# EAGLE schematic lt3652_charger (EAGLE 8.6.3)
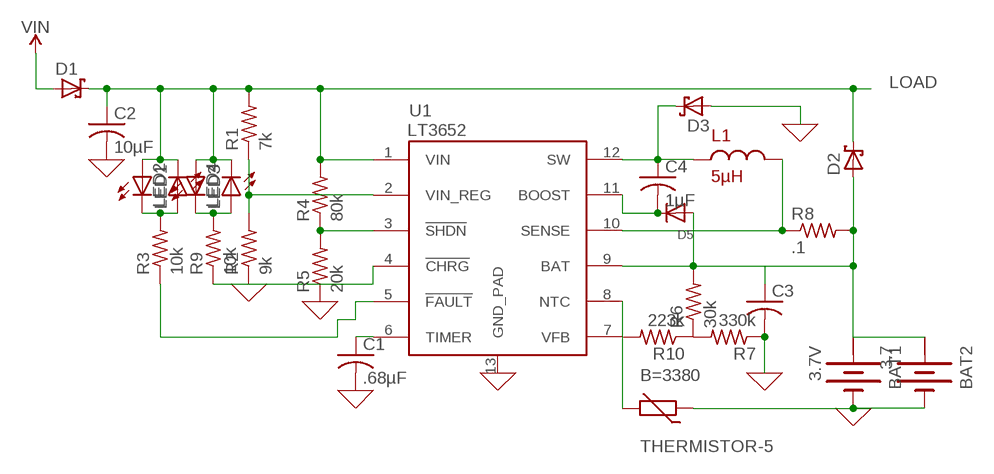
[diagram p0: schematic, sheet 1]

## Parts
B=3380  THERMISTOR-5  [R-5]
BAT1  3.7V  BATTERY  [BATTERY]
BAT2  3.7  BATTERY  [BATTERY]
C1  .68µF  C-US025-024X044  [C025-024X044]
C2  10µF  C-US025-024X044  [C025-024X044]
C3  C-US025-024X044  [C025-024X044]
C4  1µF  C-US025-024X044  [C025-024X044]
D1  SCHOTTKY-DIODEAG  [AG]
D2  SCHOTTKY-DIODEAG  [AG]
D3  SCHOTTKY-DIODEAG  [AG]
D5  DIODEDO-1N4148  [DO-1N4148]
L1  5µH  L  (no package)
LED1  LED5MM  [LED5MM]
LED2  LED5MM  [LED5MM]
LED3  LED5MM  [LED5MM]
LED4  LED5MM  [LED5MM]
R1  7k  R-US_0204/2V  [0204V]
R2  9k  R-US_0204/2V  [0204V]
R3  10k  R-US_0204/2V  [0204V]
R4  80k  R-US_0204/2V  [0204V]
R5  20k  R-US_0204/2V  [0204V]
R6  30k  R-US_0204/2V  [0204V]
R7  330k  R-US_0204/2V  [0204V]
R8  .1  R-US_0204/2V  [0204V]
R9  10k  R-US_0204/2V  [0204V]
R10  223k  R-US_0204/2V  [0204V]
U1  LT3652  [MSOP-12_GND]

## Nets
0: B=3380.1 BAT1.- BAT2.- C1.2 C2.2 C3.2 D3.A R2.1 R5.1 R7.1 U1.13(GND_PAD) ; supply symbol labelled GND
LOAD: C2.1 D1.C D2.C LED1.A LED2.K(C) LED3.A LED4.K(C) R1.2 R4.2 U1.1(VIN)
N$1: C1.1 U1.6(TIMER)
N$2: R1.1 R2.2 U1.2(VIN_REG)
N$3: R4.1 R5.2 U1.3(!SHDN)
N$4: LED1.K(C) LED2.A R3.2
N$5: LED3.K(C) LED4.A
N$6: R3.1 U1.5(!FAULT)
N$7: L1.2 R8.1 U1.10(SENSE)
N$8: BAT1.+ BAT2.+ C3.1 D2.A D5.A R6.2 R8.2 U1.9(BAT)
N$9: R6.1 R7.2
N$10: C4.1 D3.C L1.1 U1.12(SW)
N$11: C4.2 D5.C U1.11(BOOST)
N$12: R9.1 U1.4(!CHRG)
N$13: B=3380.2 U1.8(NTC)
VIN: D1.A
Unconnected: R9.2 R10.1 R10.2 U1.7(VFB)

## Power pins joined to a net without a drawn wire
+: BAT1.+@1(+) BAT2.+@1(+)

## Library data of the parts
B=3380 = varistor:THERMISTOR: THERMISTOR
BAT1 BAT2 = special:BATTERY: BATTERY
C1-C4 = adafruit:C-US: CAPACITOR, American symbol
D1-D3 = adafruit:SCHOTTKY-DIODE: Schottky Diode
D5 = adafruit:DIODE: Diode SMADIODE - SMA Surface Mount Package 20V 1A Schottky Diode Digikey: 641-1014-6-ND DO-1N4148 - Through Hole Small Current Diode SOD-123 20V 1 A (.5mV Vf) Schottky Diode - Digikey: MBRX120TPMSCT-ND SOD-323 10V 570mA (.38mV Vf, 3ns) Schottky Diode - Digikey: ZLLS410CT-ND SOD-523 30V 30mA Schottky Diode (RB751S-40TE61) - Digikey: RB751S-40TE61CT-ND SOT23-R/W - SOT23 Package (R = Solder Paste/Reflow Ovens, W = Hand-Soldering) BAT54Film 40V 300mA - Digikey: 497-7162-1-ND
L1 = ngspice-simulation:L: INDUCTOR
LED1-LED4 = adafruit:LED: LED OSRAM: - CHIPLED LG R971, LG N971, LY N971, LG Q971, LY Q971, LO R971, LY R971 LH N974, LH R974 LS Q976, LO Q976, LY Q976 LO Q996 - Hyper CHIPLED LW Q18S LB Q993, LB Q99A, LB R99A - SideLED LS A670, LO A670, LY A670, LG A670, LP A670 LB A673, LV A673, LT A673, LW A673 LH A674 LY A675 LS A676, LA A676, LO A676, LY A676, LW A676 LS A679, LY A679, LG A679 - Hyper Micro SIDELED® LS Y876, LA Y876, LO Y876, LY Y876 LT Y87S - SmartLED LW L88C, LW L88S LB L89C, LB L89S, LG L890 LS L89K, LO L89K, LY L89K LS L896, LA L896, LO L896, LY L896 - TOPLED LS T670, LO T670, LY T670, LG T670, LP T670 LSG T670, LSP T670, LSY T670, LOP T670, LYG T670 LG T671, LOG T671, LSG T671 LB T673, LV T673, LT T673, LW T673 LH T674 LS T676, LA T676, LO T676, LY T676, LB T676, LH T676, LSB T676, LW T676 LB T67C, LV T67C, LT T67C, LS T67K, LO T67K, LY T67K, LW E67C LS E67B, LA E67B, LO E67B, LY E67B, LB E67C, LV E67C, LT E67C LW T67C LS T679, LY T679, LG T679 LS T770, LO T770, LY T770, LG T770, LP T770 LB T773, LV T773, LT T773, LW T773 LH T774 LS E675, LA E675, LY E675, LS T675 LS T776, LA T776, LO T776, LY T776, LB T776 LHGB T686 LT T68C, LB T68C - Hyper Mini TOPLED® LB M676 - Mini TOPLED Santana® LG M470 LS M47K, LO M47K, LY M47K Source: http://www.osram.convergy.de/
R1-R9 = adafruit:R-US_: RESISTOR, American symbol
R10 = adafruit:R-US_: RESISTOR, American symbol; SPICEPREFIX: R
U1 = SparkFun-IC-Power:LT3652: LT3652 MPPT Solar Charge Controller(IC-11822) 5V-32V smart charger for batteries up to 14.4V